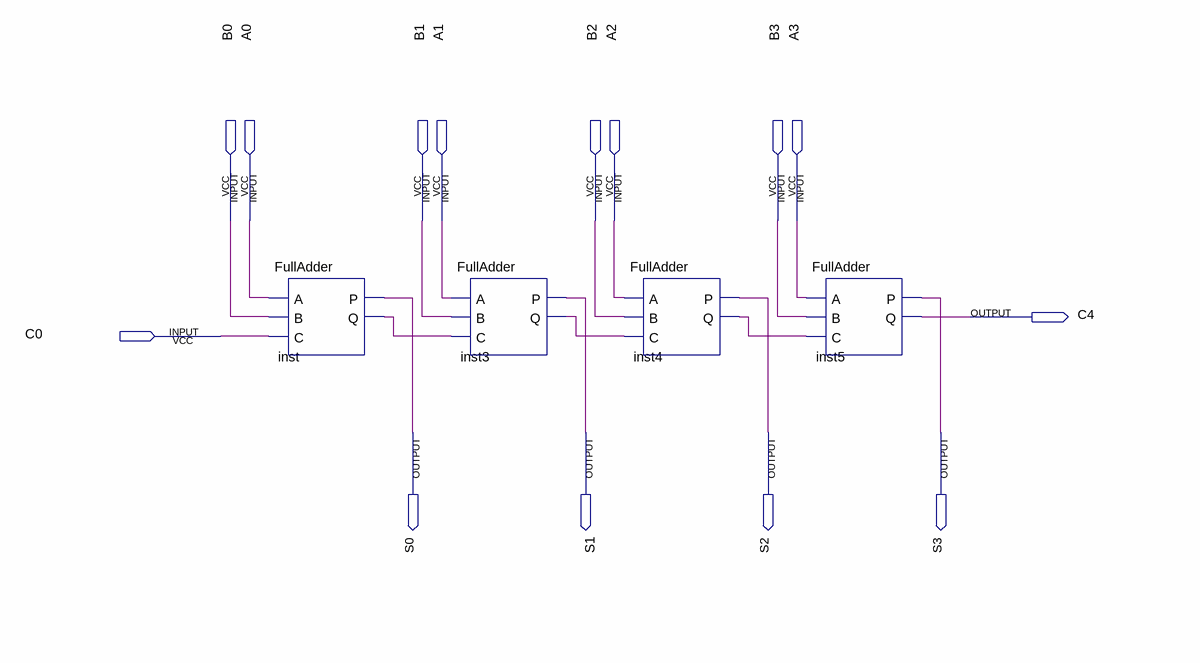
[diagram p0: schematic sheet]
// Quartus schematic RippleCarryAdder.bdf as structural Verilog: 4 symbols, 14 pins
module RippleCarryAdder (
  input  B0,
  input  A0,
  input  B1,
  input  A1,
  input  B2,
  input  A2,
  input  B3,
  input  A3,
  input  C0,
  output C4,
  output S0,
  output S1,
  output S2,
  output S3
);

  wire inst3_q, inst4_q, inst_q;

  FullAdder inst (.A(A0), .B(B0), .C(C0), .P(S0), .Q(inst_q));
  FullAdder inst3 (.A(A1), .B(B1), .C(inst_q), .P(S1), .Q(inst3_q));
  FullAdder inst4 (.A(A2), .B(B2), .C(inst3_q), .P(S2), .Q(inst4_q));
  FullAdder inst5 (.A(A3), .B(B3), .C(inst4_q), .P(S3), .Q(C4));
endmodule
